# EAGLE design PLACA_CONECTORES (EAGLE 9.6.2)
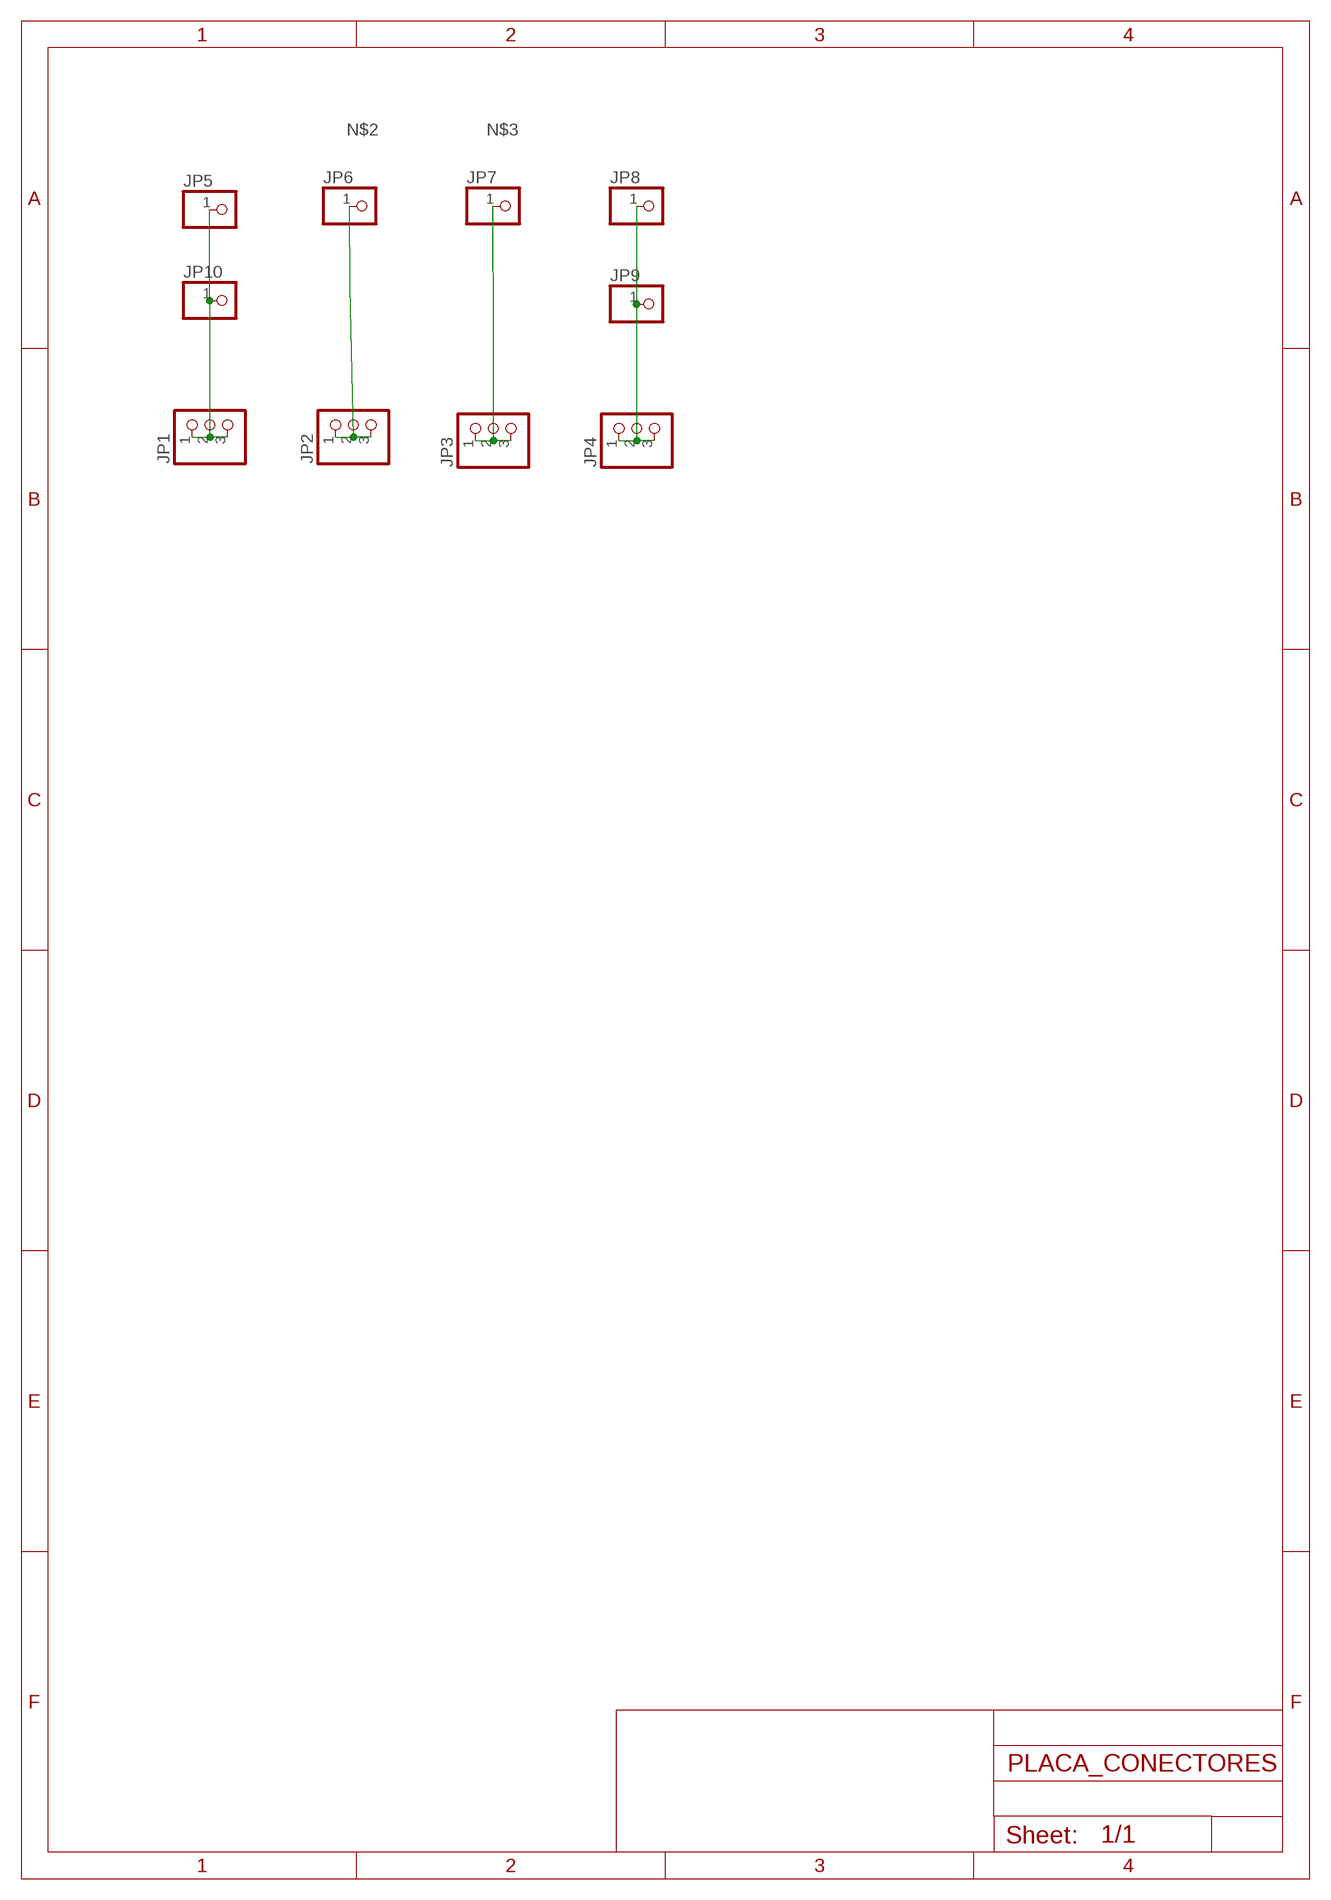
[diagram p0: schematic, sheet 1]

## Parts
JP1  PINHD-1X3/90  [1X03/90]
JP2  PINHD-1X3/90  [1X03/90]
JP3  PINHD-1X3/90  [1X03/90]
JP4  PINHD-1X3/90  [1X03/90]
JP5  PINHD-1X1  [1X01]
JP6  PINHD-1X1  [1X01]
JP7  PINHD-1X1  [1X01]
JP8  PINHD-1X1  [1X01]
JP9  PINHD-1X1  [1X01]
JP10  PINHD-1X1  [1X01]

## Nets
N$1: JP1.1 JP1.2 JP1.3 JP5.1 JP10.1
N$2: JP2.1 JP2.2 JP2.3 JP6.1
N$3: JP3.1 JP3.2 JP3.3 JP7.1
N$4: JP4.1 JP4.2 JP4.3 JP8.1 JP9.1

## Library data of the parts
JP1-JP4 = pinhead:PINHD-1X3: PIN HEADER
JP5-JP10 = pinhead:PINHD-1X1: PIN HEADER

## Board
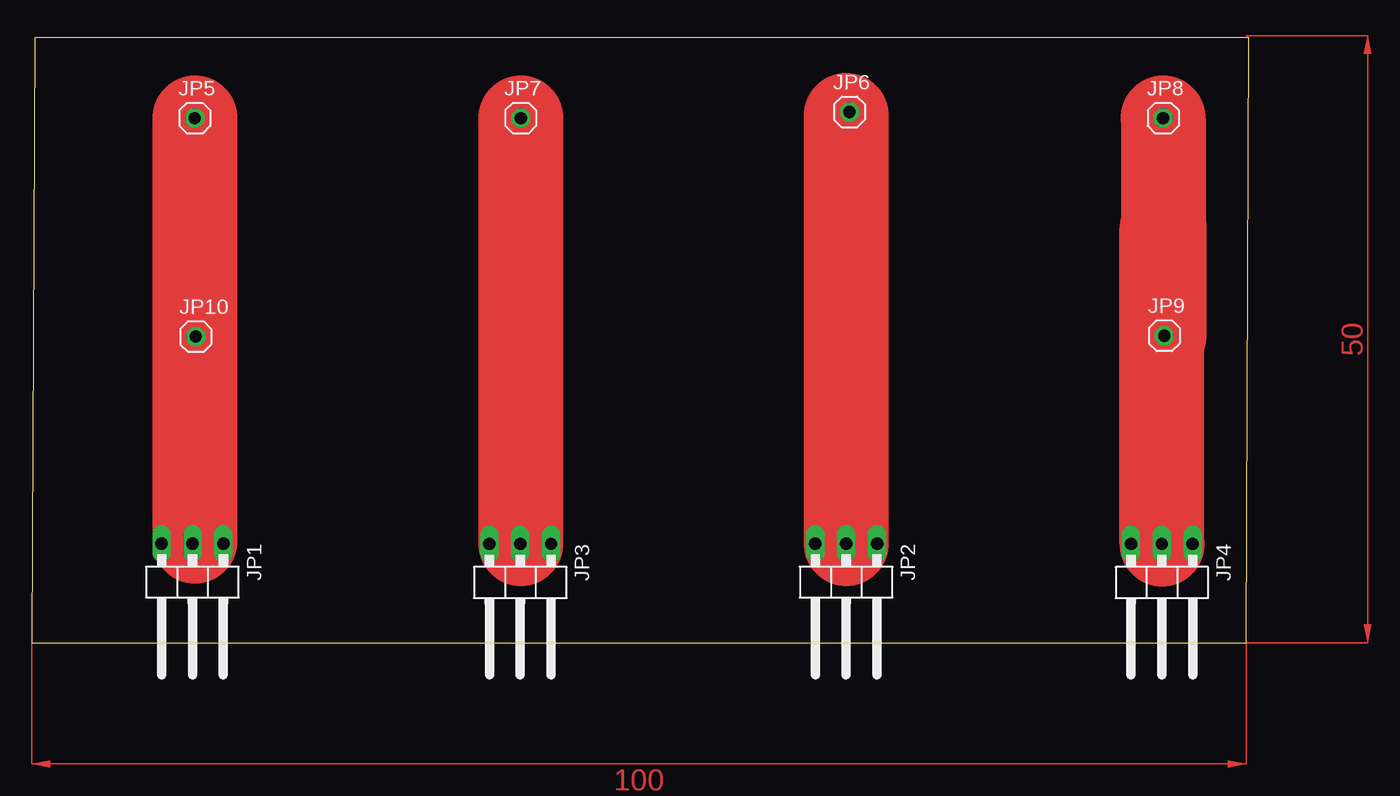
[diagram p1: board, top side]

Size 100.23 x 49.85 mm. Coordinates in mm from the lower left corner, seen from the top.
Outline: 0,0 100,0 100.23,49.85 0.23,49.85 0,0
Copper layers (1*16): Top 0.035mm / dielectric 1.5mm / Bottom 0.035mm
Design rules "default": minimum track width 6mil, minimum drill 0.35mm, track to track 6mil, track to pad 6mil, pad to pad 6mil, via to via 6mil, smd to smd 6mil, copper to edge 40mil, drill to drill 6mil, minimum pad ring 10mil, minimum via ring 8mil, stop-mask expansion 4mil, vias tented up to drill 0mil, thermal gap 10mil

### Footprints (pad centres in the part's own frame; a part is rotated, then mirrored left to right if it is on the bottom)
1X03/90 = drill 1.016 long: 1 -2.54,-3.81; 2 0,-3.81; 3 2.54,-3.81
1X01 = drill 1.016 octagon: 1 0,0

### Placement (x,y rotation side)
JP1  13.22,4.35 180 top
JP2  67.06,4.35 180 top
JP3  40.22,4.32 180 top
JP4  93.06,4.32 180 top
JP5  13.41,43.21 0 top
JP6  67.33,43.71 0 top
JP7  40.25,43.21 0 top
JP8  93.17,43.21 0 top
JP9  93.26,25.29 0 top
JP10  13.49,25.21 0 top

### Tracks (layer width: path | path; a pad name or v marks a point on that pad's centre or on a via)
N$1
  Top 0.152: 13.41,25.13 JP10.1
  Top 1.016: JP1.1 JP1.2 JP1.3
  Top 2.54: JP1.2 13.41,8.35
  Top 7: 13.41,8.35 13.41,25.13 JP5.1
N$2
  Top 0.152: 67.06,43.44 JP6.1
  Top 1.016: JP2.1 JP2.2 JP2.3
  Top 7: 67.06,43.44 JP2.2
N$3
  Top 0.152: JP3.2 40.28,8.19 40.28,8.13 40.25,8.16
  Top 1.016: JP3.1 JP3.3 40.28,8.13
  Top 7: JP7.1 40.25,8.16
N$4
  Top 1.016: JP4.3 JP4.2 JP4.1
  Top 4.5: JP9.1 93.17,25.38 | 93.26,34.33 93.06,34.13
  Top 7: JP8.1 93.17,25.38 | JP4.2 93.06,34.13 | JP9.1 93.26,34.33
(copper drawn outside any net)
  shapes: Top area x3